# Altium schematic sheet 3V_Switch.SchDoc
size A
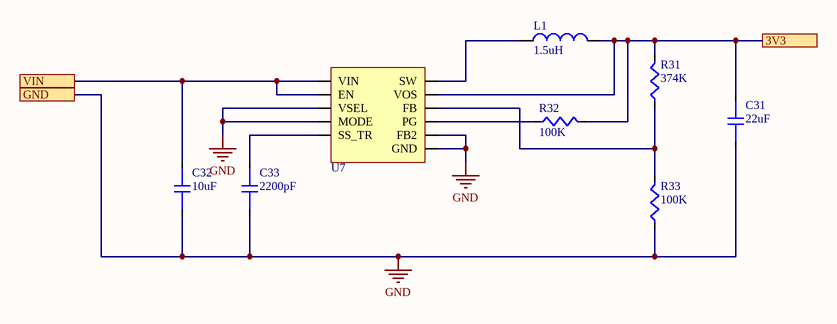
[diagram p0: 3V_Switch.SchDoc]

## Parts
C31  22uF
C32  10uF
C33  2200pF
L1  1.5uH
R31  374K
R32  100K
R33  100K
U7  TPS621361RGXR  (value not drawn)

## Ports
3V3, GND, VIN

## Nets
GND: C31.1 C32.1 C33.1 R33.2 U7.3(GND) U7.4(FB2) U7.10(MODE) U7.11(VSEL) ; port GND
3V3: C31.2 L1.2 R31.1 R32.1 U7.6(VOS) ; port 3V3
VIN: C32.2 U7.1(VIN) U7.8(EN) ; port VIN
NetC33_2: C33.2 U7.9(SS_TR)
NetL1_1: L1.1 U7.2(SW)
NetR31_2: R31.2 R33.1 U7.5(FB)
NetR32_2: R32.2 U7.7(PG)

## Library data of the parts
C31 = GRM21BD70J226ME44L: CAP CER 22UF 6.3V X7T 0805; Dielectric Material: Ceramic; Capacitance: 10uF; Tolerance: 20%; Voltage Rating: 25V; Dielectric: X5R; RoHS: Yes; Mount: Surface Mount; Case/Package: 0603; Weight: 7.1E-05oz; Case Code (Imperial): 0603; Case Code (Metric): 1608; Min Operating Temperature: -55°C; Max Operating Temperature: 85°C; Packaging: Tape and Reel; Termination: SMD/SMT; Voltage Rating (DC): 25V; Composition: Ceramic; Package Quantity: 1; Length: 1.6mm; Height: 0.8mm; Width: 0.8mm; Thickness: 0.039inch; Depth: 0.8mm; Lead Free: Lead Free; REACH SVHC: No SVHC; ComponentLink1URL: http://components.arrow.com/part/dataview/0323_06887183?src-supplier=Arrow+Europe; ComponentLink1Description: http://components.arrow.com/part/dataview/0323_06887183?src-supplier=Arrow+Europe; ComponentLink2URL: http://www.farnell.com/datasheets/2792994.pdf?src-supplier=Farnell; ComponentLink2Description: http://www.farnell.com/datasheets/2792994.pdf?src-supplier=Farnell; ComponentLink3URL: http://www.farnell.com/datasheets/2291921.pdf?src-supplier=Avnet; ComponentLink3Description: http://www.farnell.com/datasheets/2291921.pdf?src-supplier=Avnet; ComponentLink4URL: http://www.farnell.com/datasheets/2792994.pdf?src-supplier=Newark; ComponentLink4Description: http://www.farnell.com/datasheets/2792994.pdf?src-supplier=Newark; ComponentLink5URL: http://www.farnell.com/datasheets/2291921.pdf?src-supplier=Newark; ComponentLink5Description: http://www.farnell.com/datasheets/2291921.pdf?src-supplier=Newark; ComponentLink6URL: http://www.farnell.com/datasheets/2792994.pdf?src-supplier=Element14; ComponentLink6Description: http://www.farnell.com/datasheets/2792994.pdf?src-supplier=Element14; ComponentLink7URL: http://www.farnell.com/datasheets/1913358.pdf?src-supplier=Element14; ComponentLink7Description: http://www.farnell.com/datasheets/1913358.pdf?src-supplier=Element14; ComponentLink8URL: https://product.tdk.com/info/en/catalog/datasheets/mlcc_commercial_general_en.pdf?src-supplier=Digi-Key; ComponentLink8Description: https://product.tdk.com/info/en/catalog/datasheets/mlcc_commercial_general_en.pdf?src-supplier=Digi-Key; ComponentLink9URL: http://www.farnell.com/datasheets/2291921.pdf?src-supplier=RSComponents; ComponentLink9Description: http://www.farnell.com/datasheets/2291921.pdf?src-supplier=RSComponents; ComponentLink10URL: http://www.farnell.com/datasheets/2291921.pdf?src-supplier=Verical; ComponentLink10Description: http://www.farnell.com/datasheets/2291921.pdf?src-supplier=Verical; ComponentLink11URL: http://www.farnell.com/datasheets/2291921.pdf?src-supplier=Mouser; ComponentLink11Description: http://www.farnell.com/datasheets/2291921.pdf?src-supplier=Mouser; ComponentLink12URL: http://www.farnell.com/datasheets/2291921.pdf?src-supplier=Quest; ComponentLink12Description: http://www.farnell.com/datasheets/2291921.pdf?src-supplier=Quest; ComponentLink13URL: http://www.farnell.com/datasheets/2291921.pdf?src-supplier=TTI; ComponentLink13Description: http://www.farnell.com/datasheets/2291921.pdf?src-supplier=TTI; Supplier 1: Digi-Key; Supplier Part Number 1: 490-14659-1-ND
C32 = GRM31CR71E106KA12L: CAP CER 10UF 25V X7R 1206; Dielectric Material: Ceramic; Tolerance: 20%; Dielectric: X5R; RoHS: Yes; Mount: Surface Mount; Case/Package: 0603; Weight: 7.1E-05oz; Case Code (Imperial): 0603; Case Code (Metric): 1608; Min Operating Temperature: -55°C; Max Operating Temperature: 85°C; Capacitance: 10uF; Packaging: Tape and Reel; Voltage Rating: 25V; Termination: SMD/SMT; Voltage Rating (DC): 25V; Composition: Ceramic; Package Quantity: 1; Length: 1.6mm; Height: 0.8mm; Width: 0.8mm; Thickness: 0.039inch; Depth: 0.8mm; Lead Free: Lead Free; REACH SVHC: No SVHC; ComponentLink1URL: http://components.arrow.com/part/dataview/0323_06887183?src-supplier=Arrow+Europe; ComponentLink1Description: http://components.arrow.com/part/dataview/0323_06887183?src-supplier=Arrow+Europe; ComponentLink2URL: http://www.farnell.com/datasheets/2792994.pdf?src-supplier=Farnell; ComponentLink2Description: http://www.farnell.com/datasheets/2792994.pdf?src-supplier=Farnell; ComponentLink3URL: http://www.farnell.com/datasheets/2291921.pdf?src-supplier=Avnet; ComponentLink3Description: http://www.farnell.com/datasheets/2291921.pdf?src-supplier=Avnet; ComponentLink4URL: http://www.farnell.com/datasheets/2792994.pdf?src-supplier=Newark; ComponentLink4Description: http://www.farnell.com/datasheets/2792994.pdf?src-supplier=Newark; ComponentLink5URL: http://www.farnell.com/datasheets/2291921.pdf?src-supplier=Newark; ComponentLink5Description: http://www.farnell.com/datasheets/2291921.pdf?src-supplier=Newark; ComponentLink6URL: http://www.farnell.com/datasheets/2792994.pdf?src-supplier=Element14; ComponentLink6Description: http://www.farnell.com/datasheets/2792994.pdf?src-supplier=Element14; ComponentLink7URL: http://www.farnell.com/datasheets/1913358.pdf?src-supplier=Element14; ComponentLink7Description: http://www.farnell.com/datasheets/1913358.pdf?src-supplier=Element14; ComponentLink8URL: https://product.tdk.com/info/en/catalog/datasheets/mlcc_commercial_general_en.pdf?src-supplier=Digi-Key; ComponentLink8Description: https://product.tdk.com/info/en/catalog/datasheets/mlcc_commercial_general_en.pdf?src-supplier=Digi-Key; ComponentLink9URL: http://www.farnell.com/datasheets/2291921.pdf?src-supplier=RSComponents; ComponentLink9Description: http://www.farnell.com/datasheets/2291921.pdf?src-supplier=RSComponents; ComponentLink10URL: http://www.farnell.com/datasheets/2291921.pdf?src-supplier=Verical; ComponentLink10Description: http://www.farnell.com/datasheets/2291921.pdf?src-supplier=Verical; ComponentLink11URL: http://www.farnell.com/datasheets/2291921.pdf?src-supplier=Mouser; ComponentLink11Description: http://www.farnell.com/datasheets/2291921.pdf?src-supplier=Mouser; ComponentLink12URL: http://www.farnell.com/datasheets/2291921.pdf?src-supplier=Quest; ComponentLink12Description: http://www.farnell.com/datasheets/2291921.pdf?src-supplier=Quest; ComponentLink13URL: http://www.farnell.com/datasheets/2291921.pdf?src-supplier=TTI; ComponentLink13Description: http://www.farnell.com/datasheets/2291921.pdf?src-supplier=TTI; Supplier 1: Digi-Key; Supplier Part Number 1: 490-6518-1-ND
C33 = GRM155R71E222KA01D: CAP CER 2200PF 25V X7R 0402; Dielectric Material: Ceramic; Capacitance: 10uF; Tolerance: 20%; Dielectric: X5R; RoHS: Yes; Mount: Surface Mount; Case/Package: 0603; Weight: 7.1E-05oz; Case Code (Imperial): 0603; Case Code (Metric): 1608; Min Operating Temperature: -55°C; Max Operating Temperature: 85°C; Packaging: Tape and Reel; Voltage Rating: 25V; Termination: SMD/SMT; Voltage Rating (DC): 25V; Composition: Ceramic; Package Quantity: 1; Length: 1.6mm; Height: 0.8mm; Width: 0.8mm; Thickness: 0.039inch; Depth: 0.8mm; Lead Free: Lead Free; REACH SVHC: No SVHC; ComponentLink1URL: http://components.arrow.com/part/dataview/0323_06887183?src-supplier=Arrow+Europe; ComponentLink1Description: http://components.arrow.com/part/dataview/0323_06887183?src-supplier=Arrow+Europe; ComponentLink2URL: http://www.farnell.com/datasheets/2792994.pdf?src-supplier=Farnell; ComponentLink2Description: http://www.farnell.com/datasheets/2792994.pdf?src-supplier=Farnell; ComponentLink3URL: http://www.farnell.com/datasheets/2291921.pdf?src-supplier=Avnet; ComponentLink3Description: http://www.farnell.com/datasheets/2291921.pdf?src-supplier=Avnet; ComponentLink4URL: http://www.farnell.com/datasheets/2792994.pdf?src-supplier=Newark; ComponentLink4Description: http://www.farnell.com/datasheets/2792994.pdf?src-supplier=Newark; ComponentLink5URL: http://www.farnell.com/datasheets/2291921.pdf?src-supplier=Newark; ComponentLink5Description: http://www.farnell.com/datasheets/2291921.pdf?src-supplier=Newark; ComponentLink6URL: http://www.farnell.com/datasheets/2792994.pdf?src-supplier=Element14; ComponentLink6Description: http://www.farnell.com/datasheets/2792994.pdf?src-supplier=Element14; ComponentLink7URL: http://www.farnell.com/datasheets/1913358.pdf?src-supplier=Element14; ComponentLink7Description: http://www.farnell.com/datasheets/1913358.pdf?src-supplier=Element14; ComponentLink8URL: https://product.tdk.com/info/en/catalog/datasheets/mlcc_commercial_general_en.pdf?src-supplier=Digi-Key; ComponentLink8Description: https://product.tdk.com/info/en/catalog/datasheets/mlcc_commercial_general_en.pdf?src-supplier=Digi-Key; ComponentLink9URL: http://www.farnell.com/datasheets/2291921.pdf?src-supplier=RSComponents; ComponentLink9Description: http://www.farnell.com/datasheets/2291921.pdf?src-supplier=RSComponents; ComponentLink10URL: http://www.farnell.com/datasheets/2291921.pdf?src-supplier=Verical; ComponentLink10Description: http://www.farnell.com/datasheets/2291921.pdf?src-supplier=Verical; ComponentLink11URL: http://www.farnell.com/datasheets/2291921.pdf?src-supplier=Mouser; ComponentLink11Description: http://www.farnell.com/datasheets/2291921.pdf?src-supplier=Mouser; ComponentLink12URL: http://www.farnell.com/datasheets/2291921.pdf?src-supplier=Quest; ComponentLink12Description: http://www.farnell.com/datasheets/2291921.pdf?src-supplier=Quest; ComponentLink13URL: http://www.farnell.com/datasheets/2291921.pdf?src-supplier=TTI; ComponentLink13Description: http://www.farnell.com/datasheets/2291921.pdf?src-supplier=TTI; Supplier 1: Digi-Key; Supplier Part Number 1: 490-5419-1-ND
L1 = IHLP2020CZER1R5M01: FIXED IND 1.5UH 7.2A 20.7 MOHM; Manufacturer 1: Wurth Electronics; Manufacturer Part Number 1: 74438357022; Core Material: Metal,Composite; Inductance: 2.2uH; Tolerance: 20%; Current Rating: 5.2A; Saturation Current: 7A; Shielding: Shielded; DC Resistance (DCR): 26mR; Self Resonant Frequency: 35MHz; Test Frequency: 100kHz; Supplier 1: Digi-Key; Supplier Part Number 1: 732-11201-1-ND; Stock 1: 1686; Pricing 1: 1=1.58000, 10=1.50700, 50=1.45200, 100=1.32000 (USD); RoHS: No; Mount: Surface Mount; Case/Package: Nonstandard; Min Operating Temperature: -40°C; Max Operating Temperature: 125°C; Packaging: Cut Tape; ComponentLink1URL: http://www.farnell.com/datasheets/2579569.pdf?src-supplier=Farnell; ComponentLink1Description: http://www.farnell.com/datasheets/2579569.pdf?src-supplier=Farnell; ComponentLink2URL: https://katalog.we-online.de/pbs/datasheet/74438357022.pdf?src-supplier=Digi-Key; ComponentLink2Description: https://katalog.we-online.de/pbs/datasheet/74438357022.pdf?src-supplier=Digi-Key; ComponentLink3URL: http://www.farnell.com/datasheets/2579569.pdf?src-supplier=Newark; ComponentLink3Description: http://www.farnell.com/datasheets/2579569.pdf?src-supplier=Newark
R31 = CRCW0402374KFKED: RES SMD 374K OHM 1% 1/16W 0402; Dielectric Material: Ceramic; Capacitance: 10uF; Tolerance: 20%; Voltage Rating: 25V; Dielectric: X5R; RoHS: Yes; Mount: Surface Mount; Case/Package: 0603; Weight: 7.1E-05oz; Case Code (Imperial): 0603; Case Code (Metric): 1608; Min Operating Temperature: -55°C; Max Operating Temperature: 85°C; Packaging: Tape and Reel; Termination: SMD/SMT; Voltage Rating (DC): 25V; Composition: Ceramic; Package Quantity: 1; Length: 1.6mm; Height: 0.8mm; Width: 0.8mm; Thickness: 0.039inch; Depth: 0.8mm; Lead Free: Lead Free; REACH SVHC: No SVHC; ComponentLink1URL: http://components.arrow.com/part/dataview/0323_06887183?src-supplier=Arrow+Europe; ComponentLink1Description: http://components.arrow.com/part/dataview/0323_06887183?src-supplier=Arrow+Europe; ComponentLink2URL: http://www.farnell.com/datasheets/2792994.pdf?src-supplier=Farnell; ComponentLink2Description: http://www.farnell.com/datasheets/2792994.pdf?src-supplier=Farnell; ComponentLink3URL: http://www.farnell.com/datasheets/2291921.pdf?src-supplier=Avnet; ComponentLink3Description: http://www.farnell.com/datasheets/2291921.pdf?src-supplier=Avnet; ComponentLink4URL: http://www.farnell.com/datasheets/2792994.pdf?src-supplier=Newark; ComponentLink4Description: http://www.farnell.com/datasheets/2792994.pdf?src-supplier=Newark; ComponentLink5URL: http://www.farnell.com/datasheets/2291921.pdf?src-supplier=Newark; ComponentLink5Description: http://www.farnell.com/datasheets/2291921.pdf?src-supplier=Newark; ComponentLink6URL: http://www.farnell.com/datasheets/2792994.pdf?src-supplier=Element14; ComponentLink6Description: http://www.farnell.com/datasheets/2792994.pdf?src-supplier=Element14; ComponentLink7URL: http://www.farnell.com/datasheets/1913358.pdf?src-supplier=Element14; ComponentLink7Description: http://www.farnell.com/datasheets/1913358.pdf?src-supplier=Element14; ComponentLink8URL: https://product.tdk.com/info/en/catalog/datasheets/mlcc_commercial_general_en.pdf?src-supplier=Digi-Key; ComponentLink8Description: https://product.tdk.com/info/en/catalog/datasheets/mlcc_commercial_general_en.pdf?src-supplier=Digi-Key; ComponentLink9URL: http://www.farnell.com/datasheets/2291921.pdf?src-supplier=RSComponents; ComponentLink9Description: http://www.farnell.com/datasheets/2291921.pdf?src-supplier=RSComponents; ComponentLink10URL: http://www.farnell.com/datasheets/2291921.pdf?src-supplier=Verical; ComponentLink10Description: http://www.farnell.com/datasheets/2291921.pdf?src-supplier=Verical; ComponentLink11URL: http://www.farnell.com/datasheets/2291921.pdf?src-supplier=Mouser; ComponentLink11Description: http://www.farnell.com/datasheets/2291921.pdf?src-supplier=Mouser; ComponentLink12URL: http://www.farnell.com/datasheets/2291921.pdf?src-supplier=Quest; ComponentLink12Description: http://www.farnell.com/datasheets/2291921.pdf?src-supplier=Quest; ComponentLink13URL: http://www.farnell.com/datasheets/2291921.pdf?src-supplier=TTI; ComponentLink13Description: http://www.farnell.com/datasheets/2291921.pdf?src-supplier=TTI; Supplier 1: Digi-Key; Supplier Part Number 1: 541-374KLCT-ND
R32 R33 = CRCW0402100KFKED: RES SMD 100K OHM 1% 1/16W 0402; Dielectric Material: Ceramic; Capacitance: 10uF; Tolerance: 20%; Voltage Rating: 25V; Dielectric: X5R; RoHS: Yes; Mount: Surface Mount; Case/Package: 0603; Weight: 7.1E-05oz; Case Code (Imperial): 0603; Case Code (Metric): 1608; Min Operating Temperature: -55°C; Max Operating Temperature: 85°C; Packaging: Tape and Reel; Termination: SMD/SMT; Voltage Rating (DC): 25V; Composition: Ceramic; Package Quantity: 1; Length: 1.6mm; Height: 0.8mm; Width: 0.8mm; Thickness: 0.039inch; Depth: 0.8mm; Lead Free: Lead Free; REACH SVHC: No SVHC; ComponentLink1URL: http://components.arrow.com/part/dataview/0323_06887183?src-supplier=Arrow+Europe; ComponentLink1Description: http://components.arrow.com/part/dataview/0323_06887183?src-supplier=Arrow+Europe; ComponentLink2URL: http://www.farnell.com/datasheets/2792994.pdf?src-supplier=Farnell; ComponentLink2Description: http://www.farnell.com/datasheets/2792994.pdf?src-supplier=Farnell; ComponentLink3URL: http://www.farnell.com/datasheets/2291921.pdf?src-supplier=Avnet; ComponentLink3Description: http://www.farnell.com/datasheets/2291921.pdf?src-supplier=Avnet; ComponentLink4URL: http://www.farnell.com/datasheets/2792994.pdf?src-supplier=Newark; ComponentLink4Description: http://www.farnell.com/datasheets/2792994.pdf?src-supplier=Newark; ComponentLink5URL: http://www.farnell.com/datasheets/2291921.pdf?src-supplier=Newark; ComponentLink5Description: http://www.farnell.com/datasheets/2291921.pdf?src-supplier=Newark; ComponentLink6URL: http://www.farnell.com/datasheets/2792994.pdf?src-supplier=Element14; ComponentLink6Description: http://www.farnell.com/datasheets/2792994.pdf?src-supplier=Element14; ComponentLink7URL: http://www.farnell.com/datasheets/1913358.pdf?src-supplier=Element14; ComponentLink7Description: http://www.farnell.com/datasheets/1913358.pdf?src-supplier=Element14; ComponentLink8URL: https://product.tdk.com/info/en/catalog/datasheets/mlcc_commercial_general_en.pdf?src-supplier=Digi-Key; ComponentLink8Description: https://product.tdk.com/info/en/catalog/datasheets/mlcc_commercial_general_en.pdf?src-supplier=Digi-Key; ComponentLink9URL: http://www.farnell.com/datasheets/2291921.pdf?src-supplier=RSComponents; ComponentLink9Description: http://www.farnell.com/datasheets/2291921.pdf?src-supplier=RSComponents; ComponentLink10URL: http://www.farnell.com/datasheets/2291921.pdf?src-supplier=Verical; ComponentLink10Description: http://www.farnell.com/datasheets/2291921.pdf?src-supplier=Verical; ComponentLink11URL: http://www.farnell.com/datasheets/2291921.pdf?src-supplier=Mouser; ComponentLink11Description: http://www.farnell.com/datasheets/2291921.pdf?src-supplier=Mouser; ComponentLink12URL: http://www.farnell.com/datasheets/2291921.pdf?src-supplier=Quest; ComponentLink12Description: http://www.farnell.com/datasheets/2291921.pdf?src-supplier=Quest; ComponentLink13URL: http://www.farnell.com/datasheets/2291921.pdf?src-supplier=TTI; ComponentLink13Description: http://www.farnell.com/datasheets/2291921.pdf?src-supplier=TTI
U7 = TPS621361RGXR: 3-17V 4.0A Step-Down Converter with 1% accuracy and PFM/Forced-PWM in 2x3QFN; Manufacturer 1: Texas Instruments; Output Type: Adjustable; Output Configuration: Positive; Number of Outputs: 1; Min Input Voltage: 3V; Max Input Voltage: 17V; Min Output Voltage: 800mV; Max Output Voltage: 12V; Output Current: 4A; Switching Frequency: 1MHz; Synchronous Rectifier: Yes; Supplier 1: Digi-Key; Supplier Part Number 1: 296-50117-1-ND; Manufacturer Part Number 1: TPS621361RGXR; Stock 1: 3019; Pricing 1: 1=2.15000, 10=1.93500, 25=1.82520, 100=1.46000, 250=1.27752, 500=1.24100, 1000=0.98550 (USD); RoHS: No; Mount: Surface Mount; Case/Package: VQFN; Number of Pins: 11; Min Operating Temperature: -40°C; Max Operating Temperature: 125°C; Packaging: Cut Tape; ComponentLink1URL: http://www.ti.com/lit/ds/symlink/tps62136.pdf?src-supplier=Digi-Key; ComponentLink1Description: http://www.ti.com/lit/ds/symlink/tps62136.pdf?src-supplier=Digi-Key